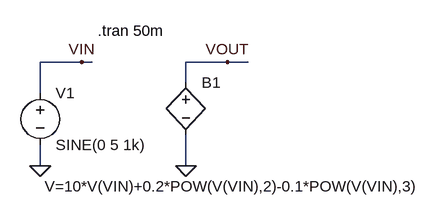
[diagram p0: schematic fig-02-05-27.asc]
fig-02-05-27.asc, the LTspice schematic file:
Version 4
SHEET 1 880 680
WIRE 128 64 64 64
WIRE 144 64 128 64
WIRE 352 64 288 64
WIRE 384 64 352 64
WIRE 288 96 288 64
WIRE 64 112 64 64
WIRE 64 224 64 192
WIRE 288 224 288 176
FLAG 64 224 0
FLAG 288 224 0
FLAG 352 64 VOUT
FLAG 128 64 VIN
SYMBOL voltage 64 96 R0
WINDOW 123 0 0 Left 0
WINDOW 39 0 0 Left 0
SYMATTR InstName V1
SYMATTR Value SINE(0 5 1k)
SYMBOL bv 288 80 R0
WINDOW 3 -217 176 Left 2
SYMATTR InstName B1
SYMATTR Value V=10*V(VIN)+0.2*POW(V(VIN),2)-0.1*POW(V(VIN),3)
TEXT 152 16 Left 2 !.tran 50m

The netlist it stands for:
* fig-02-05-27.asc
V1 VIN 0 SINE(0 5 1k)
B1 VOUT 0 V=10*V(VIN)+0.2*POW(V(VIN),2)-0.1*POW(V(VIN),3)
.tran 50m
.backanno
.end